# Altium schematic sheet Black_Magic_SCH.SchDoc
size 381 x 241 mm
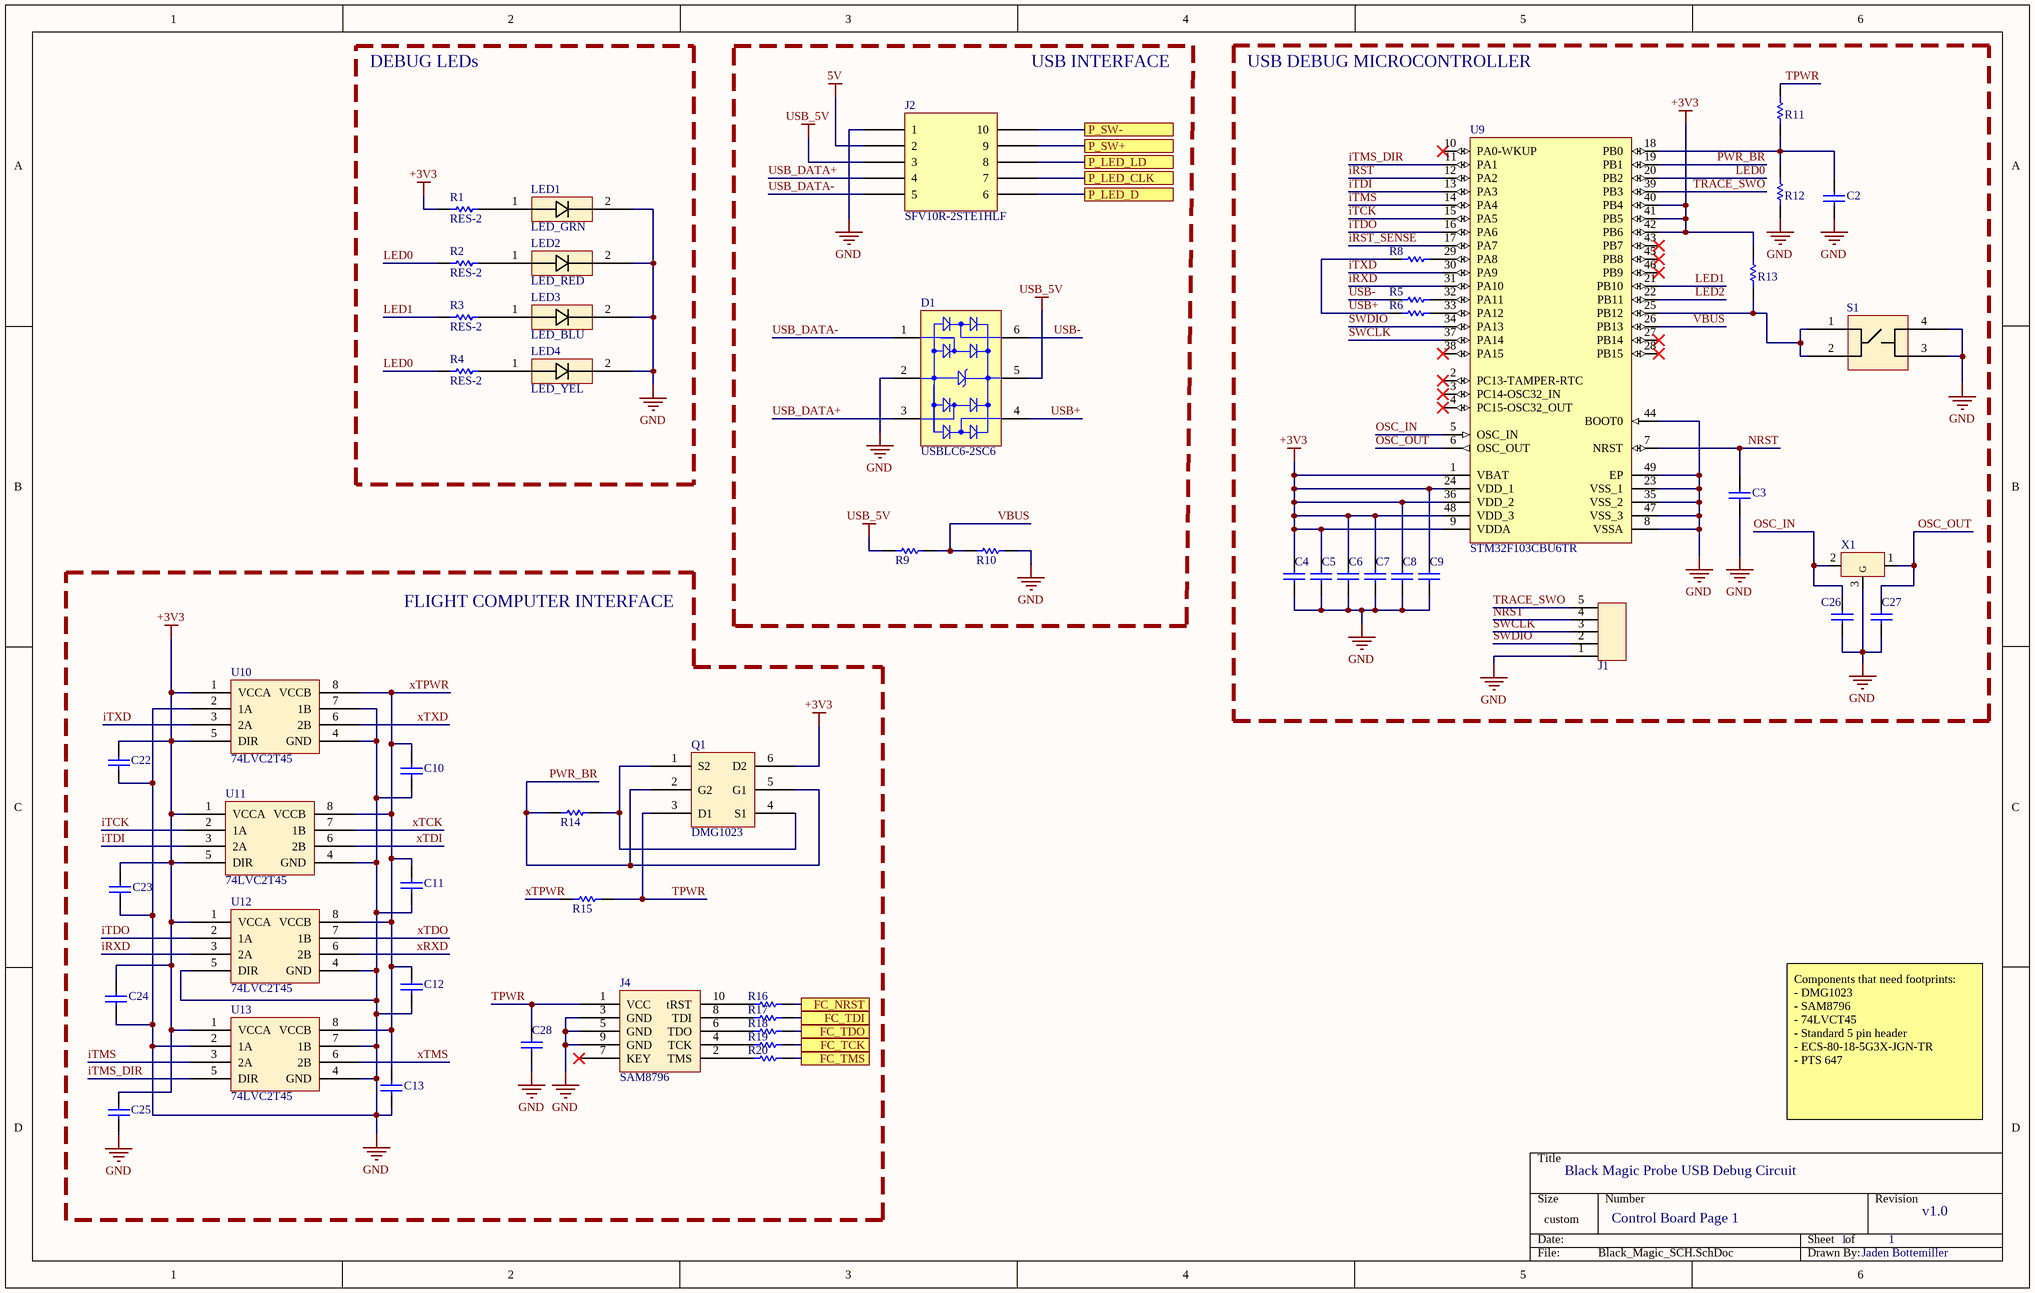
[diagram p0: Black_Magic_SCH.SchDoc]

## Parts
C2  CAP0402  [CAPC0402(1005)60_L]  (value not drawn)
C3  CAP0402  [CAPC0402(1005)60_L]  (value not drawn)
C4  CAP0402  [CAPC0402(1005)60_L]  (value not drawn)
C5  CAP0402  [CAPC0402(1005)60_L]  (value not drawn)
C6  CAP0402  [CAPC0402(1005)60_L]  (value not drawn)
C7  CAP0402  [CAPC0402(1005)60_L]  (value not drawn)
C8  CAP0402  [CAPC0402(1005)60_L]  (value not drawn)
C9  CAP0402  [CAPC0402(1005)60_L]  (value not drawn)
C10  CAP0402  [CAPC0402(1005)60_L]  (value not drawn)
C11  CAP0402  [CAPC0402(1005)60_L]  (value not drawn)
C12  CAP0402  [CAPC0402(1005)60_L]  (value not drawn)
C13  CAP0402  [CAPC0402(1005)60_L]  (value not drawn)
C22  CAP0402  [CAPC0402(1005)60_L]  (value not drawn)
C23  CAP0402  [CAPC0402(1005)60_L]  (value not drawn)
C24  CAP0402  [CAPC0402(1005)60_L]  (value not drawn)
C25  CAP0402  [CAPC0402(1005)60_L]  (value not drawn)
C26  CAP0402  [CAPC0402(1005)60_L]  (value not drawn)
C27  CAP0402  [CAPC0402(1005)60_L]  (value not drawn)
C28  CAP0402  [CAPC0402(1005)60_L]  (value not drawn)
D1  USBLC6-2SC6  [STM-SOT23-6L_V]
J1  5PIN_Standard  (value not drawn)
J2  SFV10R-2STE1HLF
J4  SAM8796
LED1  LED_GRN  [DIOC3212X08N]
LED2  LED_RED  [DIOC3212X08N]
LED3  LED_BLU  [DIOC3212X08N]
LED4  LED_YEL  [DIOC3212X08N]
Q1  DMG1023
R1  RES-2  [RES 0402]
R2  RES-2  [RES 0402]
R3  RES-2  [RES 0402]
R4  RES-2  [RES 0402]
R5  RES-2  [RES 0402]  (value not drawn)
R6  RES-2  [RES 0402]  (value not drawn)
R8  RES-2  [RES 0402]  (value not drawn)
R9  RES-2  [RES 0402]  (value not drawn)
R10  RES-2  [RES 0402]  (value not drawn)
R11  RES-2  [RES 0402]  (value not drawn)
R12  RES-2  [RES 0402]  (value not drawn)
R13  RES-2  [RES 0402]  (value not drawn)
R14  RES-2  [RES 0402]  (value not drawn)
R15  RES-2  [RES 0402]  (value not drawn)
R16  RES-2  [RES 0402]  (value not drawn)
R17  RES-2  [RES 0402]  (value not drawn)
R18  RES-2  [RES 0402]  (value not drawn)
R19  RES-2  [RES 0402]  (value not drawn)
R20  RES-2  [RES 0402]  (value not drawn)
S1  PTS 647  (value not drawn)
U9  STM32F103CBU6TR  [STM-UFQFPN48_L]
U10  74LVC2T45
U11  74LVC2T45
U12  74LVC2T45
U13  74LVC2T45
X1  ECS-80-18-5G3X-JGN-TR  (value not drawn)

## Blocks framed on the sheet
DEBUG LEDs: LED1-LED4 R1-R4
USB INTERFACE: D1 J2 R9 R10
USB DEBUG MICROCONTROLLER: C2-C9 C26 C27 J1 R5 R6 R8 R11-R13 S1 U9 X1
FLIGHT COMPUTER INTERFACE: C10-C13 C22-C25 C28 J4 Q1 R14-R20 U10-U13

## Ports
FC_NRST, FC_TCK, FC_TDI, FC_TDO, FC_TMS, P_LED_CLK, P_LED_D, P_LED_LD, P_SW+, P_SW-

## Nets
5V: J2.2
+3V3: C4.2 C5.2 C6.2 C7.2 C8.2 C9.2 C22.2 C23.2 C24.2 C25.2 Q1.6(D2) R1.1 R13.1 U9.1(VBAT) U9.9(VDDA) U9.24(VDD_1) U9.36(VDD_2) U9.40(PB4) U9.41(PB5) U9.42(PB6) U9.48(VDD_3) U10.1(VCCA) U10.5(DIR) U11.1(VCCA) U11.5(DIR) U12.1(VCCA) U13.1(VCCA)
GND: C2.1 C3.1 C4.1 C5.1 C6.1 C7.1 C8.1 C9.1 C10.1 C11.1 C12.1 C13.1 C22.1 C23.1 C24.1 C25.1 C26.1 C27.1 C28.1 D1.2(GND) J1.1(A) J2.1 J4.3(GND) J4.5(GND) J4.9(GND) LED1.2(Cathode) LED2.2(Cathode) LED3.2(Cathode) LED4.2(Cathode) R10.2 R12.2 S1.3 S1.4 U9.8(VSSA) U9.23(VSS_1) U9.35(VSS_2) U9.44(BOOT0) U9.47(VSS_3) U9.49(EP) U10.2(1A) U10.4(GND) U10.7(1B) U11.4(GND) U12.4(GND) U12.5(DIR) U13.2(1A) U13.4(GND) U13.7(1B) X1.3(G)
USB_5V: D1.5(VBUS) J2.3 R9.2
FC_NRST: R16.1 ; port FC_NRST
FC_TCK: R19.1 ; port FC_TCK
FC_TDI: R17.1 ; port FC_TDI
FC_TDO: R18.1 ; port FC_TDO
FC_TMS: R20.1 ; port FC_TMS
iRST: U9.12(PA2)
iRST_SENSE: U9.17(PA7)
iRXD: U9.31(PA10) U12.3(2A)
iTCK: U9.15(PA5) U11.2(1A)
iTDI: U9.13(PA3) U11.3(2A)
iTDO: U9.16(PA6) U12.2(1A)
iTMS: U9.14(PA4) U13.3(2A)
iTMS_DIR: U9.11(PA1) U13.5(DIR)
iTXD: U9.30(PA9) U10.3(2A)
LED0: R2.1 R4.1 U9.20(PB2)
LED1: R3.1 U9.21(PB10)
LED2: U9.22(PB11)
NRST: C3.2 J1.4(A) U9.7(NRST)
OSC_IN: C26.2 U9.5(OSC_IN) X1.2(IN/OUT)
OSC_OUT: C27.2 U9.6(OSC_OUT) X1.1(IN/OUT)
P_LED_CLK: J2.7 ; port P_LED_CLK
P_LED_D: J2.6 ; port P_LED_D
P_LED_LD: J2.8 ; port P_LED_LD
P_SW+: J2.9 ; port P_SW+
P_SW-: J2.10 ; port P_SW-
PWR_BR: Q1.2(G2) Q1.5(G1) R14.2 U9.19(PB1)
SWCLK: J1.3(A) U9.37(PA14)
SWDIO: J1.2(A) U9.34(PA13)
TPWR: C28.2 J4.1(VCC) Q1.3(D1) R11.1 R15.1
TRACE_SWO: J1.5(A) U9.39(PB3)
USB+: D1.4(I/O_3) R6.1 R8.1
USB-: D1.6(I/O_4) R5.1
USB_DATA+: D1.3(I/O_2) J2.4
USB_DATA-: D1.1(I/O_1) J2.5
VBUS: R9.1 R10.1 U9.26(PB13)
xRXD: U12.6(2B)
xTCK: U11.7(1B)
xTDI: U11.6(2B)
xTDO: U12.7(1B)
xTMS: U13.6(2B)
xTPWR: C10.2 C11.2 C12.2 C13.2 R15.2 U10.8(VCCB) U11.8(VCCB) U12.8(VCCB) U13.8(VCCB)
xTXD: U10.6(2B)
NetC2_2: C2.2 R11.2 R12.1 U9.18(PB0)
NetJ4_2: J4.2(TMS) R20.2
NetJ4_4: J4.4(TCK) R19.2
NetJ4_6: J4.6(TDO) R18.2
NetJ4_8: J4.8(TDI) R17.2
NetJ4_10: J4.10(tRST) R16.2
NetLED1_1: LED1.1(Anode) R1.2
NetLED2_1: LED2.1(Anode) R2.2
NetLED3_1: LED3.1(Anode) R3.2
NetLED4_1: LED4.1(Anode) R4.2
NetQ1_1: Q1.1(S2) Q1.4(S1) R14.1
NetR5_2: R5.2 U9.32(PA11)
NetR6_2: R6.2 U9.33(PA12)
NetR8_2: R8.2 U9.29(PA8)
NetR13_2: R13.2 S1.1 S1.2 U9.25(PB12)

Not connected (* = marked no-connect by the designer): J4 7(KEY)*; U9 2(PC13-TAMPER-RTC)* 3(PC14-OSC32_IN)* 4(PC15-OSC32_OUT)* 10(PA0-WKUP)* 27(PB14)* 28(PB15)* 38(PA15)* 43(PB7)* 45(PB8)* 46(PB9)*

## Notes on the sheet
- Black Magic Probe USB Debug Circuit
- Components that need footprints:
  - DMG1023
  - SAM8796
  - 74LVCT45
  - Standard 5 pin header
  - ECS-80-18-5G3X-JGN-TR
  - PTS 647
- Control Board Page 1
- 1
- v1.0
- Jaden Bottemiller

## Library data of the parts
C2 C3 C5 C7-C13 C22-C25 C28 = CMP-1590-00004-1: 0402 (1005 Metric) Chip Capacitor; Case-EIA: 0402; Value: 100n; Case-Metric: 1005; PackageReference: CAPC0402(1005)60
C4 = CMP-1590-00004-1: 0402 (1005 Metric) Chip Capacitor; Case-EIA: 0402; Value: 1u; Case-Metric: 1005; PackageReference: CAPC0402(1005)60
C6 = CMP-1590-00004-1: 0402 (1005 Metric) Chip Capacitor; Case-EIA: 0402; Value: 4.7u; Case-Metric: 1005; PackageReference: CAPC0402(1005)60
C26 C27 = CMP-1590-00004-1: 0402 (1005 Metric) Chip Capacitor; Case-EIA: 0402; Value: 18pF; Case-Metric: 1005; PackageReference: CAPC0402(1005)60
D1 = CMP-2000-05378-1: Very low capacitance ESD protection, 3.5 pF, -40 to 125 degC, 6-Pin SOT23, RoHS, Tape and Reel; Manufacturer: STMicroelectronics; Polarity: Uni-Directional; Clamping Voltage: 17V; Rad Hardened: No; Product Height (mm): 1.3mm; Leakage Current (Max): 0.15uA; Product Length (mm): 3.05mm; Number of Elements: 1; Peak Pulse Current: 5A; Configuration: Dual; Reverse Breakdown Voltage: 6V; Working Voltage (Max): 5V; Capacitance Value: 3.5pF; Suppressor Type: DiodeArrays; Product Depth (mm): 1.75mm; Test Current (It): 1mA; Package / Case: SOT-23; Operating Temperature Max Deg. C: 125C; Package Description: 6-Pin Small Outline Transistor, Body 2.925 x 1.625 mm, Pitch 0.95 mm; Package Reference: SOT23-6L; Datasheet Version: Rev. 5, 10/2011; Operating Temperature Min Deg. C: -40C; Mounting Style: SurfaceMount; Direction Type: Uni-Directional; Mounting: SurfaceMount; Pin Count: 6; Leakage Current: 0.15uA; Packaging: TapeandReel; Operating Temperature Classification: Automotive; Clamping Voltage (Max): 17V; Manufacturer URL: http://www.st.com/; Reverse Stand-off Voltage: 5V; Datasheet URL: http://www.st.com/st-web-ui/static/active/en/resource/technical/document/datasheet/CD00050750.pdf; Working Voltage: 5V; Operating Temp Range: -40Cto125C
J2 = SFV10R-2STE1HLF: System: Connector
LED2-LED4 = LED_GRN
R1-R4 = RES: Value: 330
R5 R6 = RES: Value: 22
R8 = RES: Value: 1.5k
R9 R11 = RES: Value: 4.7k
R10 R12 R13 = RES: Value: 10k
R14-R20 = RES: Value: 100
S1 = TactileSW
U9 = CMP-0237-00304-1: ARM Cortex-M3 32-bit MCU, 128 KB Flash, 20 KB Internal RAM, 37 I/Os, 48-Pin UFQFPN, -40 to 85 degC, Tape and Reel; I/Os (High Current): 36; Internal RAM Size (kB): 20; Operating Frequency(F) (Processor speed) (MHz): 72; Supply Voltage(Vcc) min (V): 2; FLASH Size (Prog) (kB): 128; Packing: Tape and Reel; ComponentLink2URL: http://www.st.com/st-web-ui/static/active/en/resource/technical/document/datasheet/CD00161566.pdf; ComponentLink1Description: Manufacturer URL; Package Reference: UFQFPN48; Mounting Technology: Surface Mount; Core: ARM Cortex-M3; ComponentLink2Description: Datasheet; Package Description: 48-Pin Ultra Thin Fine Pitch Quad Flat No-Lead, 7 x 7 x 0.6 mm Body, 0.5 mm Pitch, Exposed Pad; DatasheetVersion: Rev. 17; ComponentLink1URL: http://www.st.com/